# EAGLE design TriacFanout (EAGLE 6.4)
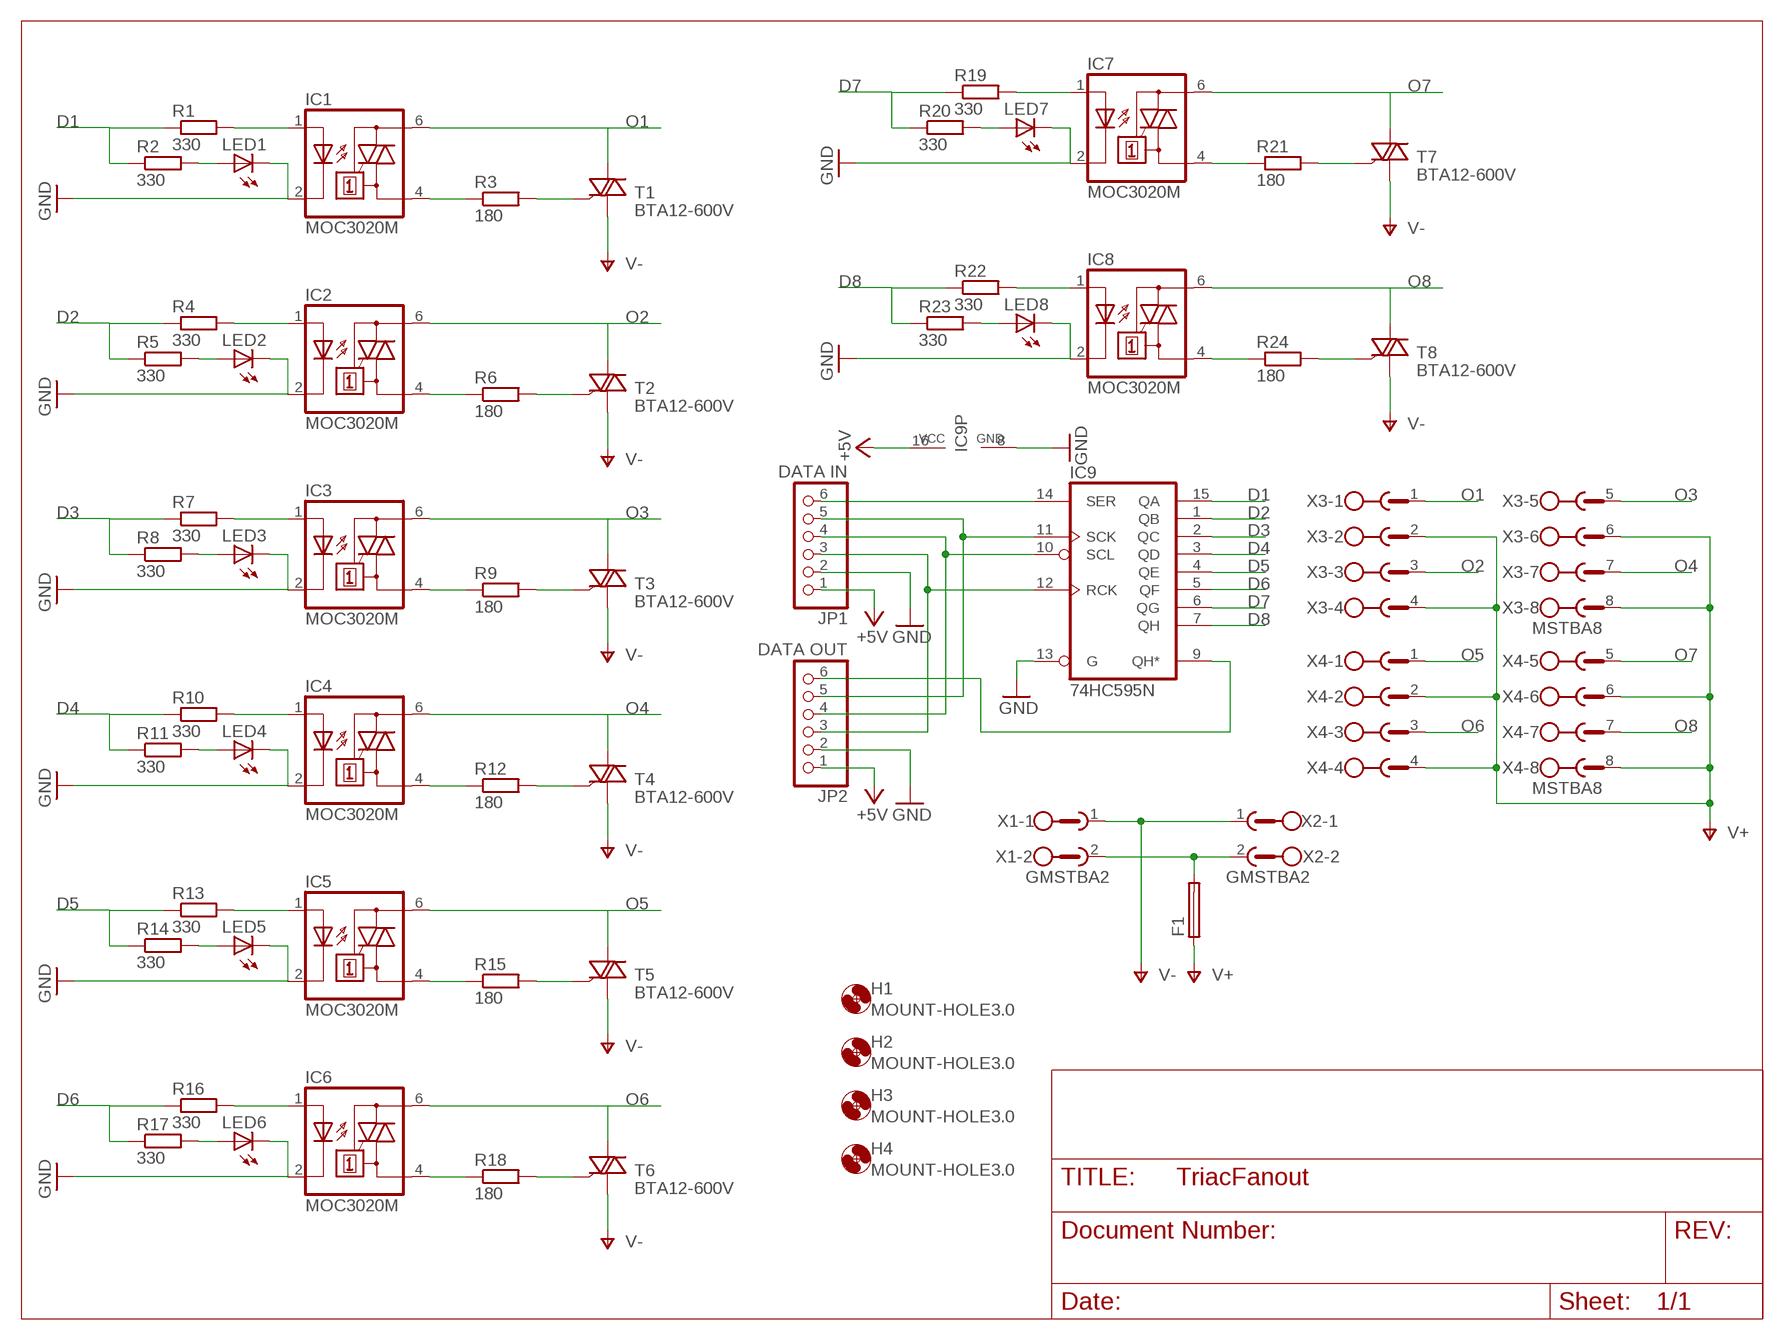
[diagram p0: schematic, sheet 1]

## Parts
F1  SH22,5  [SH22,5]
H1  MOUNT-HOLE3.0  [3,0]
H2  MOUNT-HOLE3.0  [3,0]
H3  MOUNT-HOLE3.0  [3,0]
H4  MOUNT-HOLE3.0  [3,0]
IC1  MOC3020M  [DIL06]
IC2  MOC3020M  [DIL06]
IC3  MOC3020M  [DIL06]
IC4  MOC3020M  [DIL06]
IC5  MOC3020M  [DIL06]
IC6  MOC3020M  [DIL06]
IC7  MOC3020M  [DIL06]
IC8  MOC3020M  [DIL06]
IC9  74HC595N  [DIL16]
JP1  DATA IN  PINHD-1X6  [1X06]
JP2  DATA OUT  PINHD-1X6  [1X06]
LED1  LED5MM  [LED5MM]
LED2  LED5MM  [LED5MM]
LED3  LED5MM  [LED5MM]
LED4  LED5MM  [LED5MM]
LED5  LED5MM  [LED5MM]
LED6  LED5MM  [LED5MM]
LED7  LED5MM  [LED5MM]
LED8  LED5MM  [LED5MM]
R1  330  R-EU_0204/7  [0204/7]
R2  330  R-EU_0204/7  [0204/7]
R3  180  R-EU_0204/7  [0204/7]
R4  330  R-EU_0204/7  [0204/7]
R5  330  R-EU_0204/7  [0204/7]
R6  180  R-EU_0204/7  [0204/7]
R7  330  R-EU_0204/7  [0204/7]
R8  330  R-EU_0204/7  [0204/7]
R9  180  R-EU_0204/7  [0204/7]
R10  330  R-EU_0204/7  [0204/7]
R11  330  R-EU_0204/7  [0204/7]
R12  180  R-EU_0204/7  [0204/7]
R13  330  R-EU_0204/7  [0204/7]
R14  330  R-EU_0204/7  [0204/7]
R15  180  R-EU_0204/7  [0204/7]
R16  330  R-EU_0204/7  [0204/7]
R17  330  R-EU_0204/7  [0204/7]
R18  180  R-EU_0204/7  [0204/7]
R19  330  R-EU_0204/7  [0204/7]
R20  330  R-EU_0204/7  [0204/7]
R21  180  R-EU_0204/7  [0204/7]
R22  330  R-EU_0204/7  [0204/7]
R23  330  R-EU_0204/7  [0204/7]
R24  180  R-EU_0204/7  [0204/7]
T1  BTA12-600V  [TO220V]
T2  BTA12-600V  [TO220V]
T3  BTA12-600V  [TO220V]
T4  BTA12-600V  [TO220V]
T5  BTA12-600V  [TO220V]
T6  BTA12-600V  [TO220V]
T7  BTA12-600V  [TO220V]
T8  BTA12-600V  [TO220V]
X1  GMSTBA2  [GMSTBA2]
X2  GMSTBA2  [GMSTBA2]
X3  MSTBA8  [MSTBA8]
X4  MSTBA8  [MSTBA8]

## Nets
+5V: IC9.16(VCC) JP1.1 JP2.1
D1: IC9.15(QA) R1.1 R2.1
D2: IC9.1(QB) R4.1 R5.1
D3: IC9.2(QC) R7.1 R8.1
D4: IC9.3(QD) R10.1 R11.1
D5: IC9.4(QE) R13.1 R14.1
D6: IC9.5(QF) R16.1 R17.1
D7: IC9.6(QG) R19.1 R20.1
D8: IC9.7(QH) R22.1 R23.1
GND: IC1.2(C) IC2.2(C) IC3.2(C) IC4.2(C) IC5.2(C) IC6.2(C) IC7.2(C) IC8.2(C) IC9.8(GND) IC9.13(G) JP1.2 JP2.2 LED1.K(C) LED2.K(C) LED3.K(C) LED4.K(C) LED5.K(C) LED6.K(C) LED7.K(C) LED8.K(C)
N$1: IC2.1(A) R4.2
N$2: LED2.A R5.2
N$3: IC2.4(A1) R6.1
N$4: R6.2 T2.3(G)
N$5: IC3.1(A) R7.2
N$6: LED3.A R8.2
N$7: IC3.4(A1) R9.1
N$8: R9.2 T3.3(G)
N$9: IC1.4(A1) R3.1
N$10: IC1.1(A) R1.2
N$11: R3.2 T1.3(G)
N$12: LED1.A R2.2
N$13: IC4.1(A) R10.2
N$14: LED4.A R11.2
N$15: IC4.4(A1) R12.1
N$16: R12.2 T4.3(G)
N$17: IC5.1(A) R13.2
N$18: LED5.A R14.2
N$19: IC5.4(A1) R15.1
N$20: R15.2 T5.3(G)
N$21: IC6.1(A) R16.2
N$22: LED6.A R17.2
N$23: IC6.4(A1) R18.1
N$24: R18.2 T6.3(G)
N$25: IC7.1(A) R19.2
N$26: LED7.A R20.2
N$27: IC7.4(A1) R21.1
N$28: R21.2 T7.3(G)
N$29: IC8.1(A) R22.2
N$30: LED8.A R23.2
N$31: IC8.4(A1) R24.1
N$32: R24.2 T8.3(G)
N$33: F1.2 X1.2 X2.2
N$35: IC9.14(SER) JP1.6
N$36: IC9.9(QH*) JP2.6
N$37: IC9.11(SCK) JP1.5 JP2.5
N$38: IC9.10(SCL) JP1.4 JP2.4
N$39: IC9.12(RCK) JP1.3 JP2.3
O1: IC1.6(A2) T1.2(A2) X3.1
O2: IC2.6(A2) T2.2(A2) X3.3
O3: IC3.6(A2) T3.2(A2) X3.5
O4: IC4.6(A2) T4.2(A2) X3.7
O5: IC5.6(A2) T5.2(A2) X4.1
O6: IC6.6(A2) T6.2(A2) X4.3
O7: IC7.6(A2) T7.2(A2) X4.5
O8: IC8.6(A2) T8.2(A2) X4.7
V+: F1.1 X3.2 X3.4 X3.6 X3.8 X4.2 X4.4 X4.6 X4.8
V-: T1.1(A1) T2.1(A1) T3.1(A1) T4.1(A1) T5.1(A1) T6.1(A1) T7.1(A1) T8.1(A1) X1.1 X2.1

## Library data of the parts
F1 = fuse:SH22,5: FUSE HOLDER grid 22,5 mm, OGN0031 8201, Schurter (Buerklin); MF: SCHURTER; MPN: 0031.8201; OC_FARNELL: 1162740; OC_NEWARK: 96F8317
H1-H4 = holes:MOUNT-HOLE: MOUNTING HOLE with drill center marker
IC1-IC8 = optocoupler:MOC30*M: RANDOM-PHASE OPTOISOLATORS TRIAC DRIVER OUTPUT Source: http://www.fairchildsemi.com MOC3020-M.pdf; MF: FAIRCHILD SEMICONDUCTOR; MPN: MOC3020-M; OC_FARNELL: 1505425; OC_NEWARK: 72K8895
IC9 = 74xx-eu:74*595: 8-bit SHIFT REGISTER, output latch
JP1 JP2 = pinhead:PINHD-1X6: PIN HEADER
LED1-LED8 = adafruit:LED: LED OSRAM: - CHIPLED LG R971, LG N971, LY N971, LG Q971, LY Q971, LO R971, LY R971 LH N974, LH R974 LS Q976, LO Q976, LY Q976 LO Q996 - Hyper CHIPLED LW Q18S LB Q993, LB Q99A, LB R99A - SideLED LS A670, LO A670, LY A670, LG A670, LP A670 LB A673, LV A673, LT A673, LW A673 LH A674 LY A675 LS A676, LA A676, LO A676, LY A676, LW A676 LS A679, LY A679, LG A679 - Hyper Micro SIDELED® LS Y876, LA Y876, LO Y876, LY Y876 LT Y87S - SmartLED LW L88C, LW L88S LB L89C, LB L89S, LG L890 LS L89K, LO L89K, LY L89K LS L896, LA L896, LO L896, LY L896 - TOPLED LS T670, LO T670, LY T670, LG T670, LP T670 LSG T670, LSP T670, LSY T670, LOP T670, LYG T670 LG T671, LOG T671, LSG T671 LB T673, LV T673, LT T673, LW T673 LH T674 LS T676, LA T676, LO T676, LY T676, LB T676, LH T676, LSB T676, LW T676 LB T67C, LV T67C, LT T67C, LS T67K, LO T67K, LY T67K, LW E67C LS E67B, LA E67B, LO E67B, LY E67B, LB E67C, LV E67C, LT E67C LW T67C LS T679, LY T679, LG T679 LS T770, LO T770, LY T770, LG T770, LP T770 LB T773, LV T773, LT T773, LW T773 LH T774 LS E675, LA E675, LY E675, LS T675 LS T776, LA T776, LO T776, LY T776, LB T776 LHGB T686 LT T68C, LB T68C - Hyper Mini TOPLED® LB M676 - Mini TOPLED Santana® LG M470 LS M47K, LO M47K, LY M47K Source: http://www.osram.convergy.de/
R1-R24 = resistor:R-EU_: RESISTOR, European symbol
T1-T8 = twomey:BTA12-600: Thyristor TRIAC 600 Volt 126A 3-Pin (3+Tab) TO-220AB Isolated Tube Source: http://www.jameco.com/Jameco/Products/ProdDS/2034010.pdf
X1 X2 = con-phoenix-762:GMSTBA2: PHOENIX; MF: FARNELL; MPN: 1757242; OC_FARNELL: 3705171; OC_NEWARK: 71C4161
X3 X4 = con-phoenix-508:MSTBA8: PHOENIX; MF: FARNELL; MPN: 1757307; OC_FARNELL: 3705225; OC_NEWARK: 71C4166

## Board
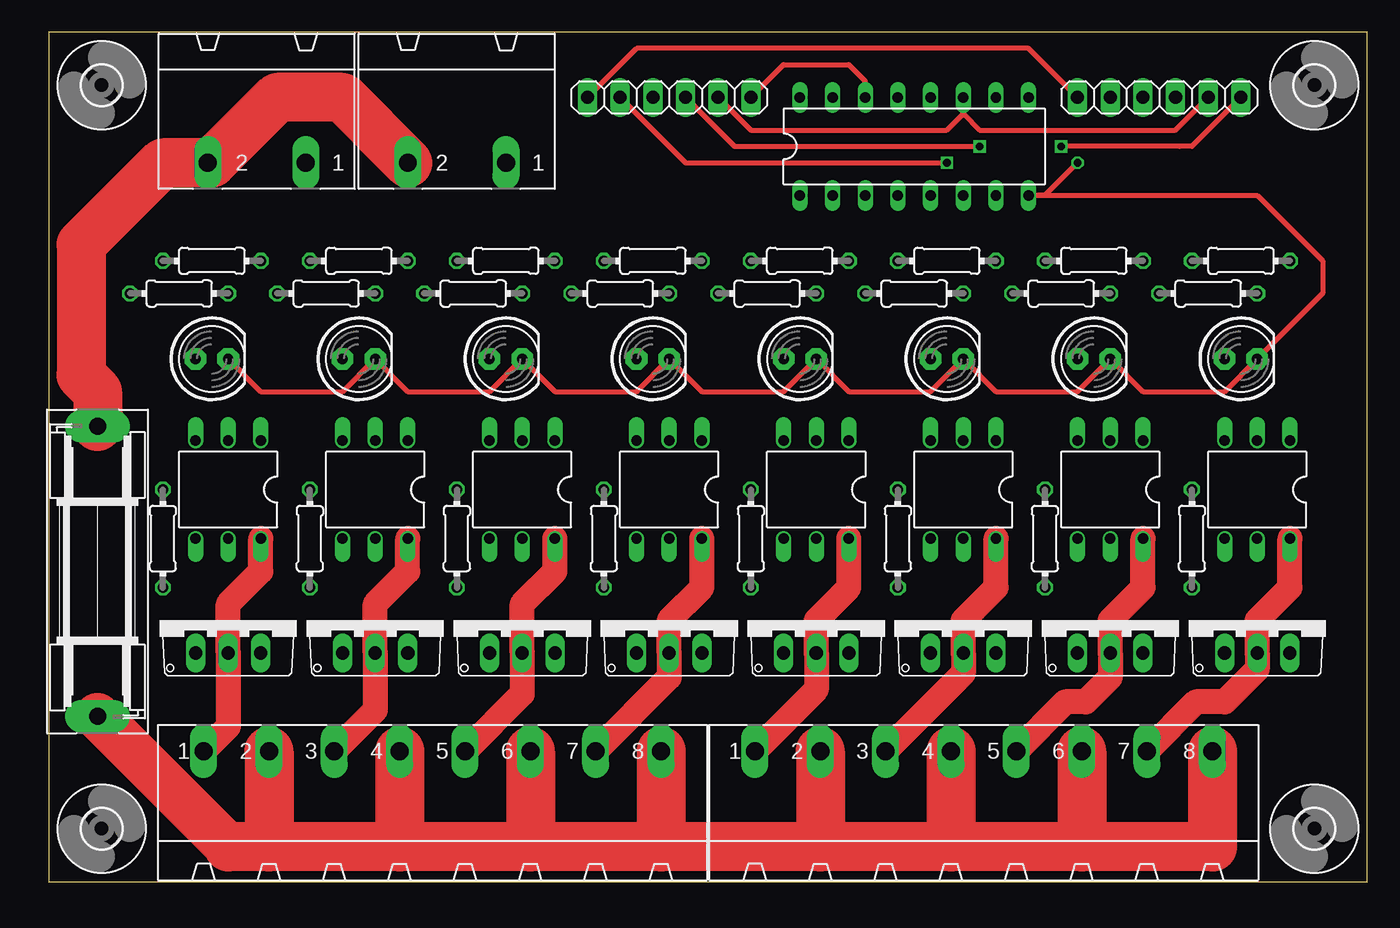
[diagram p1: board, top side]
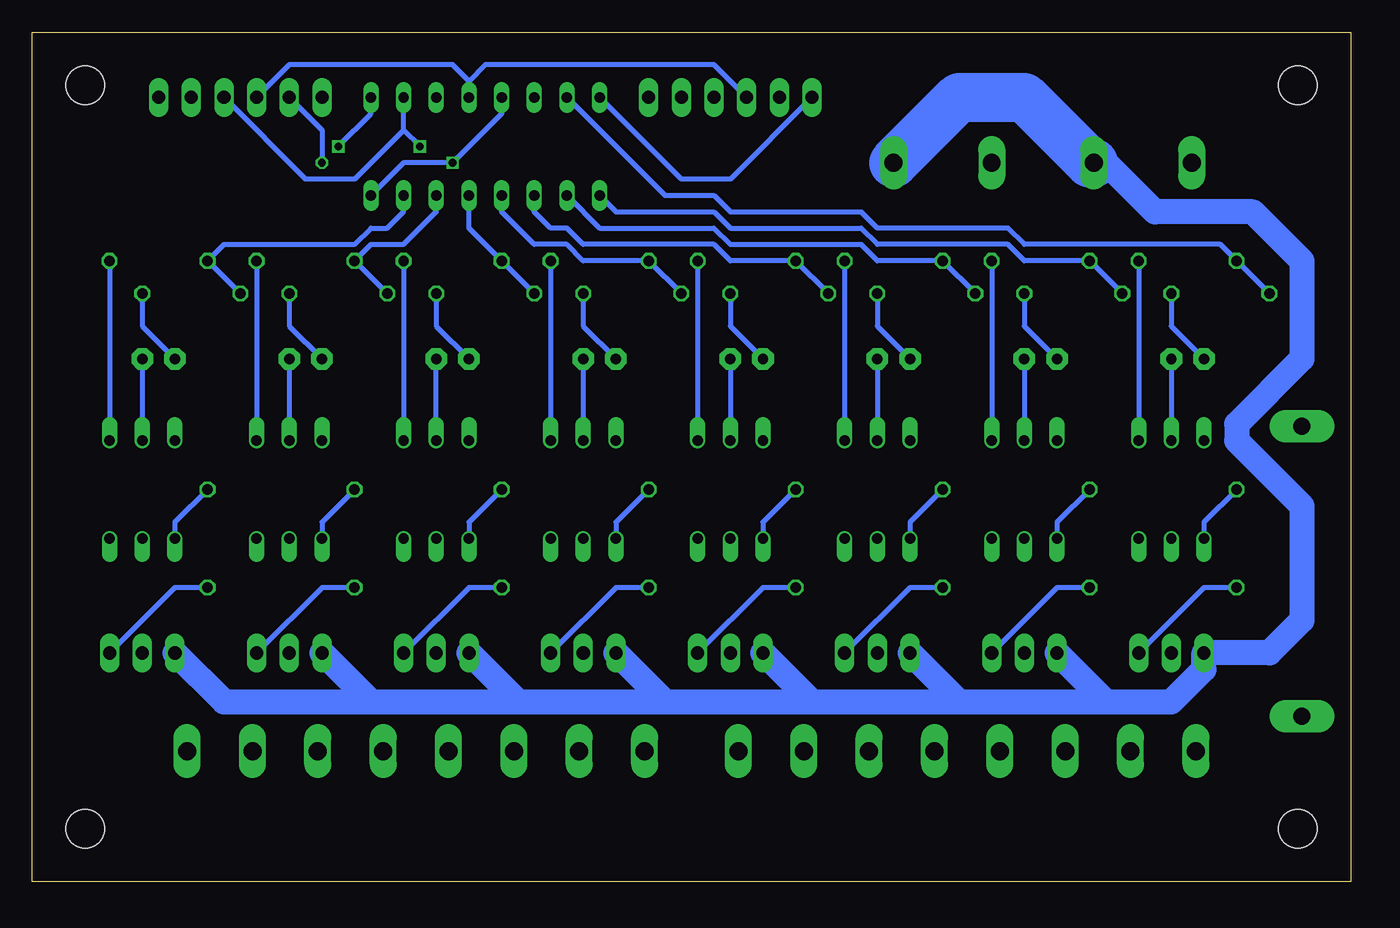
[diagram p2: board, bottom side, seen from below]

Size 102.54 x 66.03 mm. Coordinates in mm from the lower left corner, seen from the top.
Outline: 0,0 102.54,0 102.54,66.03 0,66.03 0,0
Copper layers (1*16): Top 0.0356mm / dielectric 1.5011mm / Bottom 0.0356mm
Design rules "LaenPCBOrder": minimum track width 6mil, minimum drill 13mil, track to track 6mil, track to pad 6mil, pad to pad 6mil, via to via 6mil, smd to smd 6mil, copper to edge 15mil, drill to drill 6mil, minimum pad ring 7mil, minimum via ring 7mil, stop-mask expansion 3mil, vias tented up to drill 0mil, thermal gap 10mil

### Footprints (pad centres in the part's own frame; a part is rotated, then mirrored left to right if it is on the bottom)
SH22,5 = drill 1.321 pad 2.54 long: 1 -11.252,0; 2 11.252,0
3,0 = hole 3: 0,0
DIL06 = drill 0.813 offset: 1 -2.54,-3.81; 2 0,-3.81; 3 2.54,-3.81; 4 2.54,3.81; 5 0,3.81; 6 -2.54,3.81
DIL16 = drill 0.813 long: 1 -8.89,-3.81; 2 -6.35,-3.81; 3 -3.81,-3.81; 4 -1.27,-3.81; 5 1.27,-3.81; 6 3.81,-3.81; 7 6.35,-3.81; 8 8.89,-3.81; 9 8.89,3.81; 10 6.35,3.81; 11 3.81,3.81; 12 1.27,3.81; 13 -1.27,3.81; 14 -3.81,3.81; 15 -6.35,3.81; 16 -8.89,3.81
1X06 = drill 1.016 long: 1 -6.35,0; 2 -3.81,0; 3 -1.27,0; 4 1.27,0; 5 3.81,0; 6 6.35,0
LED5MM = drill 0.813 pad 1.676 octagon: A -1.27,0; K 1.27,0
0204/7 = drill 0.813 octagon: 1 -3.81,0; 2 3.81,0
TO220V = drill 1.016 long: 1 -2.54,-2.54; 2 0,-2.54; 3 2.54,-2.54
GMSTBA2 = drill 1.397 long: 1 -3.81,5.08; 2 3.81,5.08
MSTBA8 = drill 1.397 long: 1 -17.78,5.08; 2 -12.7,5.08; 3 -7.62,5.08; 4 -2.54,5.08; 5 2.54,5.08; 6 7.62,5.08; 7 12.7,5.08; 8 17.78,5.08

### Placement (x,y rotation side)
F1  3.81,24.13 90 top
H1  4.13,4.13 0 top
H2  98.42,61.91 0 top
H3  98.42,4.13 0 top
H4  4.13,61.91 0 top
IC1  13.97,30.48 180 top
IC2  25.4,30.48 180 top
IC3  36.83,30.48 180 top
IC4  48.26,30.48 180 top
IC5  59.69,30.48 180 top
IC6  71.12,30.48 180 top
IC7  82.55,30.48 180 top
IC8  93.98,30.48 180 top
IC9  67.31,57.15 0 top
JP1  48.26,60.96 0 top
JP2  86.36,60.96 0 top
LED1  12.7,40.64 0 top
LED2  24.13,40.64 0 top
LED3  35.56,40.64 0 top
LED4  46.99,40.64 0 top
LED5  58.42,40.64 0 top
LED6  69.85,40.64 0 top
LED7  81.28,40.64 0 top
LED8  92.71,40.64 0 top
R1  12.7,48.26 0 top
R2  10.16,45.72 0 top
R3  8.89,26.67 270 top
R4  24.13,48.26 0 top
R5  21.59,45.72 0 top
R6  20.32,26.67 270 top
R7  35.56,48.26 0 top
R8  33.02,45.72 0 top
R9  31.75,26.67 270 top
R10  46.99,48.26 0 top
R11  44.45,45.72 0 top
R12  43.18,26.67 270 top
R13  58.42,48.26 0 top
R14  55.88,45.72 0 top
R15  54.61,26.67 270 top
R16  69.85,48.26 0 top
R17  67.31,45.72 0 top
R18  66.04,26.67 270 top
R19  81.28,48.26 0 top
R20  78.74,45.72 0 top
R21  77.47,26.67 270 top
R22  92.71,48.26 0 top
R23  90.17,45.72 0 top
R24  88.9,26.67 270 top
T1  13.97,20.32 0 top
T2  25.4,20.32 0 top
T3  36.83,20.32 0 top
T4  48.26,20.32 0 top
T5  59.69,20.32 0 top
T6  71.12,20.32 0 top
T7  82.55,20.32 0 top
T8  93.98,20.32 0 top
X1  16.19,60.96 180 top
X2  31.75,60.96 180 top
X3  29.84,5.08 0 top
X4  72.71,5.08 0 top

### Tracks (layer width: path | path; a pad name or v marks a point on that pad's centre or on a via)
+5V
  Top 0.406: JP1.1 45.72,64.77 76.2,64.77 JP2.1
  Bottom 0.406: JP1.1 48.26,54.61 52.07,54.61 IC9.16
D1
  Bottom 0.406: R2.1 R1.1 10.16,49.53 25.4,49.53 26.67,50.8 36.83,50.8 38.1,52.07 48.26,52.07 49.53,53.34 53.34,53.34 IC9.15
D2
  Bottom 0.406: R5.1 R4.1 25.4,48.26 26.67,49.53 36.83,49.53 38.1,50.8 48.26,50.8 49.53,52.07 57.15,52.07 IC9.1
D3
  Bottom 0.406: R8.1 R7.1 36.83,48.26 38.1,49.53 48.26,49.53 49.53,50.8 58.42,50.8 IC9.2
D4
  Bottom 0.406: R11.1 R10.1 48.26,48.26 49.53,49.53 59.69,49.53 60.96,50.8 62.23,50.8 63.5,52.07 IC9.3
D5
  Bottom 0.406: R14.1 R13.1 59.69,48.26 60.96,49.53 63.5,49.53 66.04,52.07 IC9.4
D6
  Bottom 0.406: R17.1 R16.1 68.58,50.8 IC9.5
D7
  Bottom 0.406: R20.1 R19.1 76.2,49.53 73.66,49.53 71.12,52.07 IC9.6
D8
  Bottom 0.406: R23.1 R22.1 87.63,49.53 77.47,49.53 76.2,50.8 74.93,50.8 73.66,52.07 IC9.7
GND  (via drill 0.6)
  Top 0.406: LED1.K 16.51,38.1 22.86,38.1 LED2.K 27.94,38.1 34.29,38.1 LED3.K 39.37,38.1 45.72,38.1 LED4.K 50.8,38.1 57.15,38.1 LED5.K 62.23,38.1 68.58,38.1 LED6.K 73.66,38.1 80.01,38.1 LED7.K | LED7.K 85.09,38.1 91.44,38.1 LED8.K 99.06,45.72 99.06,48.26 93.98,53.34 IC9.8 77.47,53.34 v80.01,55.88 | JP1.2 49.53,55.88 v69.85,55.88 | LED7.K 80.96,39.05
  Bottom 0.406: LED1.K IC1.2 | LED2.K IC2.2 | LED5.K IC5.2 | LED4.K IC4.2 | LED3.K IC3.2 | LED7.K IC7.2 | LED8.K IC8.2 | IC9.13 66.04,59.69 v69.85,55.88 73.66,55.88 IC9.8 | IC6.2 LED6.K | JP2.2 80.01,58.42 v80.01,55.88
N$1
  Bottom 0.406: R4.2 IC2.1
N$2
  Bottom 0.406: R5.2 25.4,43.18 LED2.A
N$3
  Bottom 0.406: R6.1 22.86,27.94 IC2.4
N$4
  Bottom 0.406: R6.2 22.86,22.86 T2.3
N$5
  Bottom 0.406: R7.2 IC3.1
N$6
  Bottom 0.406: R8.2 36.83,43.18 LED3.A
N$7
  Bottom 0.406: R9.1 34.29,27.94 IC3.4
N$8
  Bottom 0.406: R9.2 34.29,22.86 T3.3
N$9
  Bottom 0.406: R3.1 11.43,27.94 IC1.4
N$10
  Bottom 0.406: R1.2 IC1.1
N$11
  Bottom 0.406: R3.2 11.43,22.86 T1.3
N$12
  Bottom 0.406: R2.2 13.97,43.18 LED1.A
N$13
  Bottom 0.406: R10.2 IC4.1
N$14
  Bottom 0.406: R11.2 48.26,43.18 LED4.A
N$15
  Bottom 0.406: R12.1 45.72,27.94 IC4.4
N$16
  Bottom 0.406: R12.2 45.72,22.86 T4.3
N$17
  Bottom 0.406: R13.2 IC5.1
N$18
  Bottom 0.406: R14.2 59.69,43.18 LED5.A
N$19
  Bottom 0.406: R15.1 57.15,27.94 IC5.4
N$20
  Bottom 0.406: R15.2 57.15,22.86 T5.3
N$21
  Bottom 0.406: R16.2 IC6.1
N$22
  Bottom 0.406: R17.2 71.12,43.18 LED6.A
N$23
  Bottom 0.406: R18.1 68.58,27.94 IC6.4
N$24
  Bottom 0.406: R18.2 68.58,22.86 T6.3
N$25
  Bottom 0.406: R19.2 IC7.1
N$26
  Bottom 0.406: R20.2 82.55,43.18 LED7.A
N$27
  Bottom 0.406: R21.1 80.01,27.94 IC7.4
N$28
  Bottom 0.406: R21.2 80.01,22.86 T7.3
N$29
  Bottom 0.406: R22.2 IC8.1
N$30
  Bottom 0.406: R23.2 93.98,43.18 LED8.A
N$31
  Bottom 0.406: R24.1 91.44,27.94 IC8.4
N$32
  Bottom 0.406: R24.2 91.44,22.86 T8.3
N$33
  Top 3.81: X2.2 22.86,60.96 17.78,60.96 12.7,55.88 X1.2 8.89,55.88 2.54,49.53 2.54,39.37 3.81,38.1 F1.2
N$35
  Top 0.406: IC9.14 63.5,62.23 62.23,63.5 57.15,63.5 JP1.6
N$36  (via drill 0.6)
  Top 0.406: JP2.6 88.9,57.15 87.95,57.15 v78.74,57.15
  Bottom 0.406: v78.74,57.15 76.2,59.69 IC9.9
N$37
  Top 0.406: JP1.5 54.61,58.42 69.85,58.42 71.12,59.69 | IC9.11 71.12,59.69 | 71.12,59.69 72.39,58.42 87.63,58.42 JP2.5
N$38  (via drill 0.6)
  Top 0.406: JP1.4 53.34,57.15 v72.39,57.15
  Bottom 0.406: v72.39,57.15 73.66,58.42 | 73.66,58.42 IC9.10 | JP2.4 81.28,54.61 77.47,54.61 73.66,58.42
N$39
  Bottom 0.406: JP1.3 49.53,63.5 67.31,63.5 68.58,62.23 | JP2.3 82.55,63.5 69.85,63.5 68.58,62.23 | 68.58,62.23 IC9.12
O1
  Top 1.93: IC1.6 16.51,24.13 13.97,21.59 T1.2 13.97,12.06 X3.1
O2
  Top 1.93: IC2.6 27.94,24.13 25.4,21.59 T2.2 25.4,13.34 X3.3
O3
  Top 1.93: IC3.6 39.37,24.13 36.83,21.59 T3.2 36.83,14.61 X3.5
O4
  Top 1.93: IC4.6 50.8,22.86 48.26,20.32 T4.2 48.26,15.88 X3.7
O5
  Top 1.93: IC5.6 62.23,22.86 59.69,20.32 T5.2 59.69,14.92 X4.1
O6
  Top 1.93: IC6.6 73.66,22.86 71.12,20.32 T6.2 71.12,16.19 X4.3
O7
  Top 1.93: IC7.6 85.09,22.86 82.55,20.32 T7.2 82.55,15.88 80.64,13.97 79.06,13.97 X4.5
O8
  Top 1.93: IC8.6 96.52,22.86 93.98,20.32 T8.2 93.98,16.51 91.44,13.97 89.22,13.97 X4.7
V+
  Top 3.556: F1.1 13.97,2.72
  Top 3.81: 80.33,2.72 90.49,2.72 X4.8 | 80.33,2.72 70.17,2.72 | 70.17,2.72 60.01,2.72 | 60.01,2.72 47.62,2.72 | 47.62,2.72 37.47,2.72 | 37.47,2.72 27.3,2.72 | 27.3,2.72 17.14,2.72 | 17.14,2.72 13.97,2.72 | X4.6 80.33,2.72 | X4.4 70.17,2.72 | X4.2 60.01,2.72 | X3.8 47.62,2.72 | X3.6 37.47,2.72 | X3.4 27.3,2.72 | X3.2 17.14,2.72
V-
  Bottom 1.93: T2.1 19.05,13.97 | 19.05,13.97 13.97,13.97 11.43,16.51 T1.1 6.35,17.78 3.81,20.32 3.81,29.21 8.89,34.29 8.89,35.56 3.81,40.64 3.81,48.26 7.62,52.07 15.24,52.07 19.05,55.88 X1.1 | T3.1 30.48,13.97 | 30.48,13.97 19.05,13.97 | T4.1 41.91,13.97 | 41.91,13.97 30.48,13.97 | T5.1 53.34,13.97 | 53.34,13.97 41.91,13.97 | T6.1 64.77,13.97 | 64.77,13.97 53.34,13.97 | T7.1 76.2,13.97 | 76.2,13.97 64.77,13.97 | T8.1 87.63,13.97 76.2,13.97
  Bottom 3.81: X2.1 30.48,60.96 25.4,60.96 20.32,55.88 X1.1

### Text on the board
tValues: A1 | A2 | A1 | A2 | A1 | MOC3020 | MOC3020 | MOC3020 | MOC3020 | MOC3020 | MOC3020 | MOC3020 | MOC3020 | 1 | 2 | 3 | 4 | 5 | 6 | 7 | 8 | 1 | A1 | 2 | A1 | 3 | A1 | 4 | A1 | 5 | A1 | 6 | A1 | 7 | A1 | 8 | A1 | ~ | ~ | ~ | ~ | ~ | ~ | ~ | ~ | A1
bValues: Triac fanout board rev1 / boxysean Apr 2014